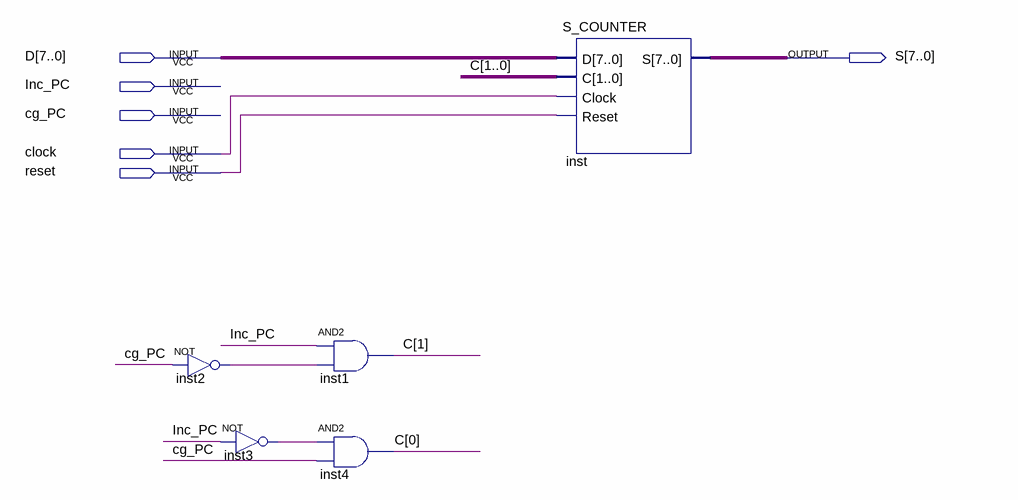
[diagram p0: schematic sheet]
// Quartus schematic PC_REGISTER.bdf as structural Verilog: 5 symbols, 6 pins
module PC_REGISTER (
  input  [7:0] D,
  input  Inc_PC,
  input  cg_PC,
  input  clock,
  input  reset,
  output [7:0] S
);

  wire inst2_out, inst3_out;
  wire [1:0] C;

  not inst2 (inst2_out, cg_PC);
  not inst3 (inst3_out, Inc_PC);
  and inst1 (C[1], Inc_PC, inst2_out);
  and inst4 (C[0], inst3_out, cg_PC);
  S_COUNTER inst (.D(D), .C(C), .Clock(clock), .Reset(reset), .S(S));
endmodule
